# EAGLE design ChaosPendulumBoard (EAGLE 9.1.2)
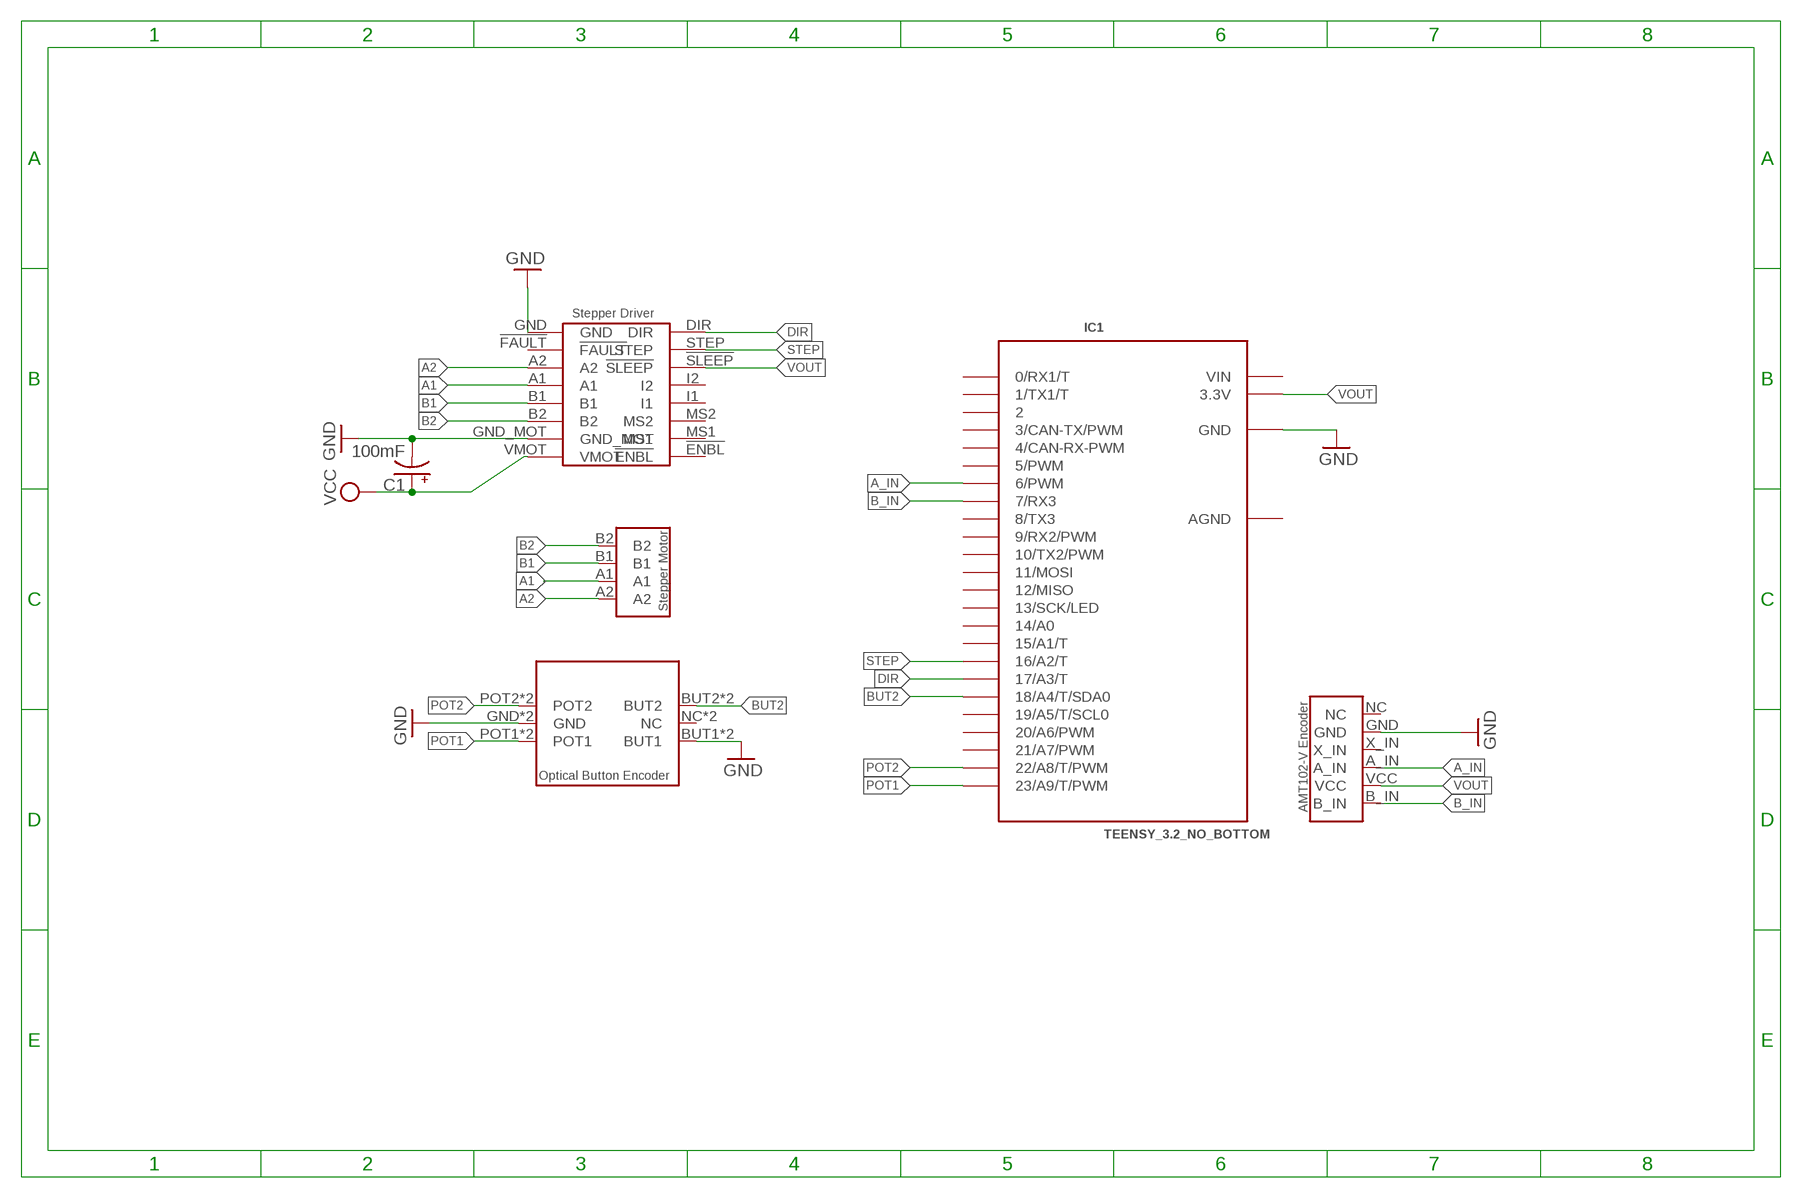
[diagram p0: schematic, sheet 1]

## Parts
C1  100mF  100UF-25V-20%(PTH)  [CPOL-RADIAL-100UF-25V]
IC1  TEENSY_3.2_NO_BOTTOM  [TEENSY_3.2_NO_BOTTOM]
U$2  STEPPER_MOTOR_MP6500  [STEPPER_MOTOR_MP6500]
U$3  OPTICAL_ENCODER_AMT102-V  [OPTICAL_ENCODER_AMT102-V]
U$4  STEPPER_NEMA_14  [STEPPER_NEMA_14]
U$5  OPTICAL_BUTTON_ENCODER  [OPTICAL_BUTTON_ENCODER]

## Nets
A1: U$2.A1 U$4.A1
A2: U$2.A2 U$4.A2
A_IN: IC1.6(6/PWM) U$3.A_IN
B1: U$2.B1 U$4.B1
B2: U$2.B2 U$4.B2
B_IN: IC1.7(7/RX3) U$3.B_IN
BUT2: IC1.18/A4(18/A4/T/SDA0) U$5.BUT2 U$5.BUT2_EXT(BUT2)
DIR: IC1.17/A3(17/A3/T) U$2.DIR
GND: C1.2(-) IC1.GND U$2.GND U$2.GND_MOT U$3.GND U$5.BUT1 U$5.BUT1_EXT(BUT1) U$5.GND U$5.GND_EXT(GND)
POT1: IC1.23/A9(23/A9/T/PWM) U$5.POT1 U$5.POT1_EXT(POT1)
POT2: IC1.22/A8(22/A8/T/PWM) U$5.POT2 U$5.POT2_EXT(POT2)
STEP: IC1.16/A2(16/A2/T) U$2.STEP
VCC: C1.1(+) U$2.VMOT
VOUT: IC1.3.3V U$2.!SLEEP U$3.VCC
Unconnected: IC1.0(0/RX1/T) IC1.1(1/TX1/T) IC1.2 IC1.3(3/CAN-TX/PWM) IC1.4(4/CAN-RX-PWM) IC1.5(5/PWM) IC1.8(8/TX3) IC1.9(9/RX2/PWM) IC1.10(10/TX2/PWM) IC1.11(11/MOSI) IC1.12(12/MISO) IC1.13(13/SCK/LED) IC1.14/A0 IC1.15/A1(15/A1/T) IC1.19/A5(19/A5/T/SCL0) IC1.20/A6(20/A6/PWM) IC1.21/A7(21/A7/PWM) U$2.!ENBL U$2.!FAULT U$2.I1 U$2.I2 U$2.MS1 U$2.MS2 U$3.NC U$3.X_IN U$5.NC U$5.NC_EXT(NC)

## Power pins joined to a net without a drawn wire
AGND: IC1.AGND
VIN: IC1.VIN

## Library data of the parts
C1 = SparkFun-Capacitors:100UF-25V-20%(PTH): CAP-08439; PROD_ID: CAP-08439
IC1 = personal:TEENSY_3.2_NO_BOTTOM: Footprint for Teensy 3.1 board using all pin connections on the outer perimeter
U$2 = Personal_Designs:STEPPER_MOTOR_MP6500
U$3 = Personal_Designs:OPTICAL_ENCODER_AMT102-V
U$4 = Personal_Designs:STEPPER_NEMA_14
U$5 = Personal_Designs:OPTICAL_BUTTON_ENCODER

## Net classes
0 default: clearance 0.205 mm

## Board
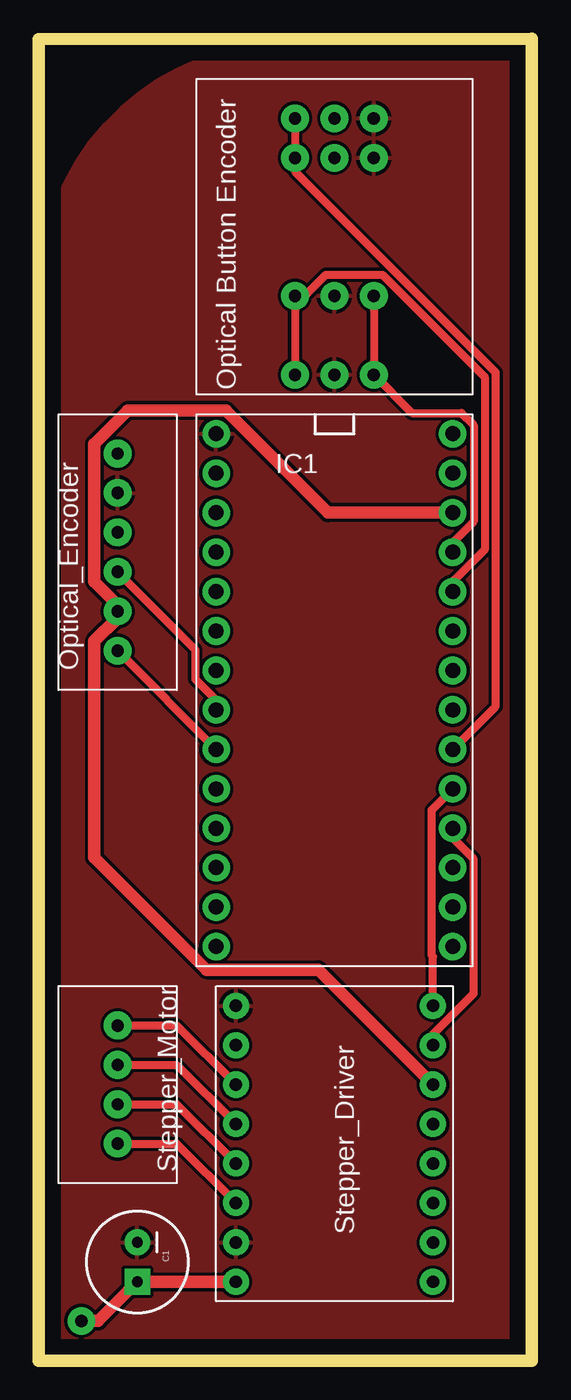
[diagram p1: board, top side]

Size 31.77 x 85.13 mm. Coordinates in mm from the lower left corner, seen from the top.
Outline: 31.77,85.13 0,85.09 0,82.55 0,57.15 0,8.62 0,0 31.75,0 31.75,2.54 31.75,17.78 31.75,65.04 31.75,83.82 31.77,85.13
Copper layers (1*16): Top 0.035mm / dielectric 1.5mm / Bottom 0.035mm
Design rules "default": minimum track width 6mil, minimum drill 0.35mm, track to track 6mil, track to pad 6mil, pad to pad 6mil, via to via 6mil, smd to smd 6mil, copper to edge 40mil, drill to drill 6mil, minimum pad ring 10mil, minimum via ring 8mil, stop-mask expansion 4mil, vias tented up to drill 0mil, thermal gap 10mil

### Footprints (pad centres in the part's own frame; a part is rotated, then mirrored left to right if it is on the bottom)
CPOL-RADIAL-100UF-25V = drill 0.7 pad 1.651 square: 1 1.27,0 | drill 0.7 pad 1.651: 2 -1.27,0
TEENSY_3.2_NO_BOTTOM = drill 0.965 pad 1.778: 0 -7.62,13.97; 1 -7.62,11.43; 2 -7.62,8.89; 3 -7.62,6.35; 3.3V 7.62,11.43; 4 -7.62,3.81; 5 -7.62,1.27; 6 -7.62,-1.27; 7 -7.62,-3.81; 8 -7.62,-6.35; 9 -7.62,-8.89; 10 -7.62,-11.43; 11 -7.62,-13.97; 12 -7.62,-16.51; 13 7.62,-16.51; 14/A0 7.62,-13.97; 15/A1 7.62,-11.43; 16/A2 7.62,-8.89; 17/A3 7.62,-6.35; 18/A4 7.62,-3.81; 19/A5 7.62,-1.27; 20/A6 7.62,1.27; 21/A7 7.62,3.81; 22/A8 7.62,6.35; 23/A9 7.62,8.89; AGND 7.62,13.97; GND -7.62,16.51; VIN 7.62,16.51
STEPPER_MOTOR_MP6500 = drill 0.8 pad 1.676: !ENBL 19.05,-1.27; !FAULT 3.81,-13.97; !SLEEP 6.35,-1.27; A1 8.89,-13.97; A2 6.35,-13.97; B1 11.43,-13.97; B2 13.97,-13.97; DIR 1.27,-1.27; GND 1.27,-13.97; GND_MOT 16.51,-13.97; I1 11.43,-1.27; I2 8.89,-1.27; MS1 16.51,-1.27; MS2 13.97,-1.27; STEP 3.81,-1.27; VMOT 19.05,-13.97
OPTICAL_ENCODER_AMT102-V = drill 0.8 pad 1.778: A_IN 7.62,-3.81; B_IN 2.54,-3.81; GND 12.7,-3.81; NC 15.24,-3.81; VCC 5.08,-3.81; X_IN 10.16,-3.81
STEPPER_NEMA_14 = drill 0.8 pad 1.778: A1 5.08,-3.81; A2 2.54,-3.81; B1 7.62,-3.81; B2 10.16,-3.81
OPTICAL_BUTTON_ENCODER = drill 0.8 pad 1.778: BUT1 6.35,-17.78; BUT1_EXT 6.35,-15.24; BUT2 11.43,-17.78; BUT2_EXT 11.43,-15.24; GND 8.89,-1.27; GND_EXT 8.89,-6.35; NC 8.89,-17.78; NC_EXT 8.89,-15.24; POT1 6.35,-1.27; POT1_EXT 6.35,-6.35; POT2 11.43,-1.27; POT2_EXT 11.43,-6.35

### Placement (x,y rotation side)
C1  6.35,6.35 270 top
IC1  19.05,43.18 0 top
U$2  26.67,24.13 270 top
U$3  1.27,43.18 90 top
U$4  8.89,24.13 270 top
U$5  27.94,62.23 180 top

### Tracks (layer width: path | path; a pad name or v marks a point on that pad's centre or on a via)
A1
  Top 0.508: U$4.A1 8.89,19.05 U$2.A1
A2
  Top 0.508: U$4.A2 8.89,21.59 U$2.A2
A_IN
  Top 0.508: U$3.A_IN 10.08,45.8 10.08,43.89 11.43,42.54 IC1.6
B1
  Top 0.508: U$4.B1 8.89,16.51 U$2.B1
B2
  Top 0.508: U$4.B2 8.89,13.97 U$2.B2
B_IN
  Top 0.508: U$3.B_IN IC1.7
BUT2
  Top 0.508: U$5.BUT2 U$5.BUT2_EXT 16.51,76.58 29.44,63.64 29.44,42.14 IC1.18/A4
DIR
  Top 0.508: U$2.DIR 25.4,26.03 25.32,26.11 25.32,35.48 IC1.17/A3
GND
  pour Top: 0,0 0,68.78 arc-90 16.11,84.9 30.7,84.9 30.7,47.24 30.7,0
POT1
  Top 0.508: U$5.POT1_EXT U$5.POT1 24.05,61.04 27.23,61.04 28.02,60.25 28.02,54.05 26.67,52.7 IC1.23/A9
POT2
  Top 0.508: U$5.POT2 U$5.POT2_EXT 17.14,68.58 18.49,69.93 22.15,69.93 28.73,63.35 28.73,52.23 26.67,50.16 IC1.22/A8
STEP
  Top 0.508: U$2.STEP 25.4,21.03 28.02,23.64 28.02,32.31 26.67,33.66 IC1.16/A2
VCC  (via drill 0.8 pad 1.78)
  Top 0.813: v2.74,2.56 3.83,2.56 C1.1 U$2.VMOT
VOUT
  Top 0.508: 5.08,48.89 U$3.VCC 5.08,47.63
  Top 0.813: IC1.3.3V 18.63,54.61 12.05,61.19 5.73,61.19 3.58,59.04 3.58,50.18 5.08,48.68 U$3.VCC 5.08,47.84 3.58,46.34 3.58,32.4 10.81,25.17 18.01,25.17 U$2.!SLEEP